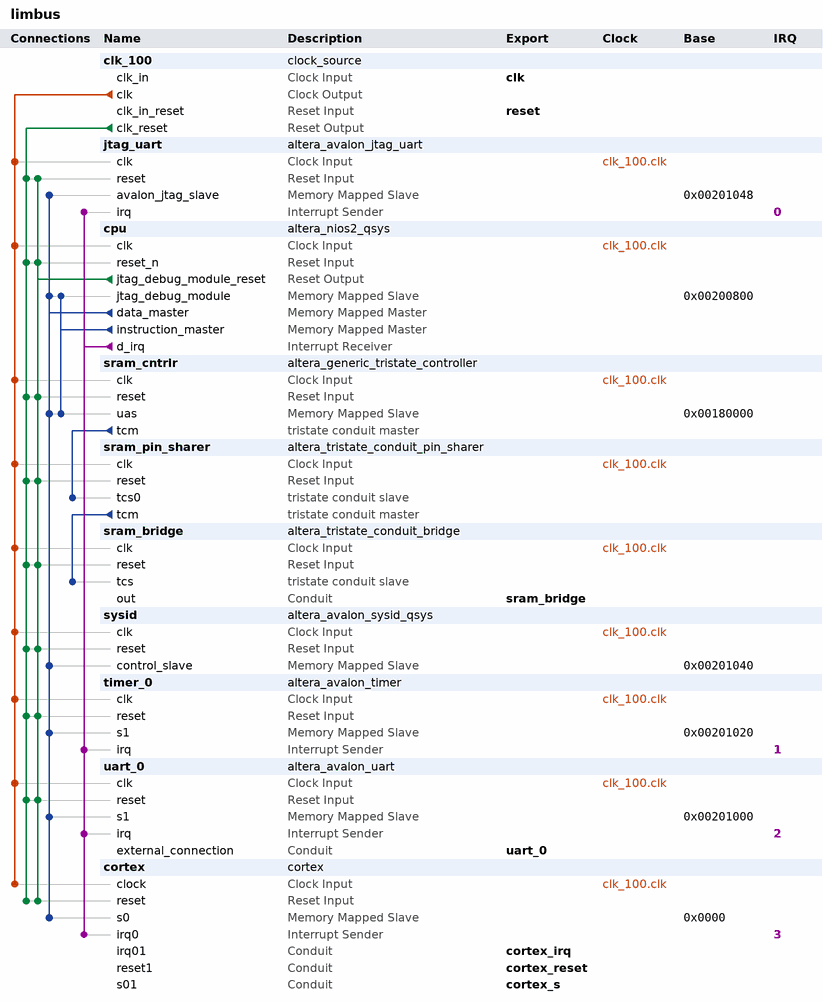
[diagram p0: system contents]
# Platform Designer (Qsys) system limbus, Cyclone V 5CGXFC5C6F27C7
# Parameters at their usual value, and those the tool derives, are not listed.
package require -exact qsys 13.1
create_system limbus
set_project_property DEVICE_FAMILY {Cyclone V}
set_project_property DEVICE 5CGXFC5C6F27C7

add_instance clk_100 clock_source 13.1
set_instance_parameter_value clk_100 clockFrequency 100000000

add_instance jtag_uart altera_avalon_jtag_uart 13.1
set_instance_parameter_value jtag_uart simInteractiveOptions NO_INTERACTIVE_WINDOWS

add_instance cpu altera_nios2_qsys 13.1
set_instance_parameter_value cpu resetSlave sram_cntrlr.uas
set_instance_parameter_value cpu mmu_TLBMissExcSlave None
set_instance_parameter_value cpu exceptionSlave sram_cntrlr.uas
set_instance_parameter_value cpu breakSlave cpu.jtag_debug_module
set_instance_parameter_value cpu impl Tiny
set_instance_parameter_value cpu icache_size 4096

add_instance sram_cntrlr altera_generic_tristate_controller 13.1
set_instance_parameter_value sram_cntrlr TCM_ADDRESS_W 19
set_instance_parameter_value sram_cntrlr TCM_DATA_W 16
set_instance_parameter_value sram_cntrlr TCM_BYTEENABLE_W 2
set_instance_parameter_value sram_cntrlr TCM_READ_WAIT 10
set_instance_parameter_value sram_cntrlr TCM_WRITE_WAIT 10
set_instance_parameter_value sram_cntrlr TCM_SETUP_WAIT 10
set_instance_parameter_value sram_cntrlr TCM_DATA_HOLD 10
set_instance_parameter_value sram_cntrlr TCM_MAX_PENDING_READ_TRANSACTIONS 3
set_instance_parameter_value sram_cntrlr TCM_TURNAROUND_TIME 2
set_instance_parameter_value sram_cntrlr TCM_TIMING_UNITS 0
set_instance_parameter_value sram_cntrlr TCM_READLATENCY 2
set_instance_parameter_value sram_cntrlr TCM_SYMBOLS_PER_WORD 2
set_instance_parameter_value sram_cntrlr USE_READ 0
set_instance_parameter_value sram_cntrlr USE_BEGINTRANSFER 0
set_instance_parameter_value sram_cntrlr USE_BYTEENABLE 1
set_instance_parameter_value sram_cntrlr USE_OUTPUTENABLE 1
set_instance_parameter_value sram_cntrlr ACTIVE_LOW_READ 0
set_instance_parameter_value sram_cntrlr ACTIVE_LOW_BYTEENABLE 1
set_instance_parameter_value sram_cntrlr ACTIVE_LOW_OUTPUTENABLE 1
set_instance_parameter_value sram_cntrlr ACTIVE_LOW_BEGINTRANSFER 0
set_instance_parameter_value sram_cntrlr CHIPSELECT_THROUGH_READLATENCY 0
set_instance_parameter_value sram_cntrlr MODULE_ASSIGNMENT_KEYS "embeddedsw.configuration.hwClassnameDriverSupportList,\\,embeddedsw.CMacro.SRAM_MEMORY_SIZE,embeddedsw.CMacro.SRAM_MEMORY_UNITS,embeddedsw.CMacro.SRAM_DATA_WIDTH,embeddedsw.memoryInfo.MEM_INIT_DATA_WIDTH,embeddedsw.memoryInfo.HAS_BYTE_LANE,embeddedsw.memoryInfo.GENERATE_DAT_SYM,embeddedsw.memoryInfo.DAT_SYM_INSTALL_DIR,embeddedsw.CMacro.SIZE"
set_instance_parameter_value sram_cntrlr MODULE_ASSIGNMENT_VALUES "altera_avalon_lan91c111\\,altera_avalon_cfi_flash,524288,1,16,16,1,1,SIM_DIR,524288"
set_instance_parameter_value sram_cntrlr INTERFACE_ASSIGNMENT_KEYS embeddedsw.configuration.isMemoryDevice
set_instance_parameter_value sram_cntrlr INTERFACE_ASSIGNMENT_VALUES 1

add_instance sram_pin_sharer altera_tristate_conduit_pin_sharer 13.1
set_instance_parameter_value sram_pin_sharer NUM_INTERFACES 1
set_instance_parameter_value sram_pin_sharer MODULE_ORIGIN_LIST sram_cntrlr.tcm,sram_cntrlr.tcm,sram_cntrlr.tcm,sram_cntrlr.tcm,sram_cntrlr.tcm,sram_cntrlr.tcm
set_instance_parameter_value sram_pin_sharer SIGNAL_ORIGIN_LIST address,outputenable_n,byteenable_n,write_n,data,chipselect_n

add_instance sram_bridge altera_tristate_conduit_bridge 13.1

add_instance sysid altera_avalon_sysid_qsys 13.1
set_instance_parameter_value sysid id 0

add_instance timer_0 altera_avalon_timer 13.1
set_instance_parameter_value timer_0 period 1
set_instance_parameter_value timer_0 periodUnits MSEC

add_instance uart_0 altera_avalon_uart 13.1
set_instance_parameter_value uart_0 baud 115200
set_instance_parameter_value uart_0 dataBits 8
set_instance_parameter_value uart_0 fixedBaud true
set_instance_parameter_value uart_0 parity NONE
set_instance_parameter_value uart_0 stopBits 1

add_instance cortex cortex 1.0

# connections
add_connection clk_100.clk cortex.clock clock
add_connection clk_100.clk cpu.clk clock
add_connection clk_100.clk jtag_uart.clk clock
add_connection clk_100.clk sram_bridge.clk clock
add_connection clk_100.clk sram_cntrlr.clk clock
add_connection clk_100.clk sram_pin_sharer.clk clock
add_connection clk_100.clk sysid.clk clock
add_connection clk_100.clk timer_0.clk clock
add_connection clk_100.clk uart_0.clk clock
add_connection clk_100.clk_reset cortex.reset reset
add_connection clk_100.clk_reset cpu.reset_n reset
add_connection clk_100.clk_reset jtag_uart.reset reset
add_connection clk_100.clk_reset sram_bridge.reset reset
add_connection clk_100.clk_reset sram_cntrlr.reset reset
add_connection clk_100.clk_reset sram_pin_sharer.reset reset
add_connection clk_100.clk_reset sysid.reset reset
add_connection clk_100.clk_reset timer_0.reset reset
add_connection clk_100.clk_reset uart_0.reset reset
add_connection cpu.jtag_debug_module_reset cortex.reset reset
add_connection cpu.jtag_debug_module_reset cpu.reset_n reset
add_connection cpu.jtag_debug_module_reset jtag_uart.reset reset
add_connection cpu.jtag_debug_module_reset sram_bridge.reset reset
add_connection cpu.jtag_debug_module_reset sram_cntrlr.reset reset
add_connection cpu.jtag_debug_module_reset sram_pin_sharer.reset reset
add_connection cpu.jtag_debug_module_reset sysid.reset reset
add_connection cpu.jtag_debug_module_reset timer_0.reset reset
add_connection cpu.jtag_debug_module_reset uart_0.reset reset
add_connection cpu.data_master cortex.s0 avalon
set_connection_parameter_value cpu.data_master/cortex.s0 baseAddress 0x0000
add_connection cpu.data_master cpu.jtag_debug_module avalon
set_connection_parameter_value cpu.data_master/cpu.jtag_debug_module baseAddress 0x00200800
add_connection cpu.data_master jtag_uart.avalon_jtag_slave avalon
set_connection_parameter_value cpu.data_master/jtag_uart.avalon_jtag_slave baseAddress 0x00201048
add_connection cpu.data_master sram_cntrlr.uas avalon
set_connection_parameter_value cpu.data_master/sram_cntrlr.uas baseAddress 0x00180000
add_connection cpu.data_master sysid.control_slave avalon
set_connection_parameter_value cpu.data_master/sysid.control_slave baseAddress 0x00201040
add_connection cpu.data_master timer_0.s1 avalon
set_connection_parameter_value cpu.data_master/timer_0.s1 baseAddress 0x00201020
add_connection cpu.data_master uart_0.s1 avalon
set_connection_parameter_value cpu.data_master/uart_0.s1 baseAddress 0x00201000
add_connection cpu.instruction_master cpu.jtag_debug_module avalon
set_connection_parameter_value cpu.instruction_master/cpu.jtag_debug_module baseAddress 0x00200800
add_connection cpu.instruction_master sram_cntrlr.uas avalon
set_connection_parameter_value cpu.instruction_master/sram_cntrlr.uas baseAddress 0x00180000
add_connection cpu.d_irq cortex.irq0 interrupt
set_connection_parameter_value cpu.d_irq/cortex.irq0 irqNumber 3
add_connection cpu.d_irq jtag_uart.irq interrupt
set_connection_parameter_value cpu.d_irq/jtag_uart.irq irqNumber 0
add_connection cpu.d_irq timer_0.irq interrupt
set_connection_parameter_value cpu.d_irq/timer_0.irq irqNumber 1
add_connection cpu.d_irq uart_0.irq interrupt
set_connection_parameter_value cpu.d_irq/uart_0.irq irqNumber 2
add_connection sram_cntrlr.tcm sram_pin_sharer.tcs0 tristate_conduit
add_connection sram_pin_sharer.tcm sram_bridge.tcs tristate_conduit

# exported interfaces
add_interface clk clock sink
set_interface_property clk EXPORT_OF clk_100.clk_in
add_interface reset reset sink
set_interface_property reset EXPORT_OF clk_100.clk_in_reset
add_interface sram_bridge conduit end
set_interface_property sram_bridge EXPORT_OF sram_bridge.out
add_interface uart_0 conduit end
set_interface_property uart_0 EXPORT_OF uart_0.external_connection
add_interface cortex_s conduit end
set_interface_property cortex_s EXPORT_OF cortex.s01
add_interface cortex_reset conduit end
set_interface_property cortex_reset EXPORT_OF cortex.reset1
add_interface cortex_irq conduit end
set_interface_property cortex_irq EXPORT_OF cortex.irq01

set_interconnect_requirement {$system} qsys_mm.clockCrossingAdapter HANDSHAKE
set_interconnect_requirement {$system} qsys_mm.maxAdditionalLatency 1
set_interconnect_requirement {$system} qsys_mm.insertDefaultSlave false

save_system limbus.qsys
